# Altium project miaow-foc-board.prjpcb (part 2 of 2)

## Sheet emmc.schdoc: EMMC
size A4; Date: 10.25.2025; CheckedBy: BCY; DrawnBy: miaow; DocumentNumber: 4; Revision: v1.0.0; SheetNumber: 4; SheetTotal: 14; BoardType: MAIN_PCB; Desc: EMMC for mcu
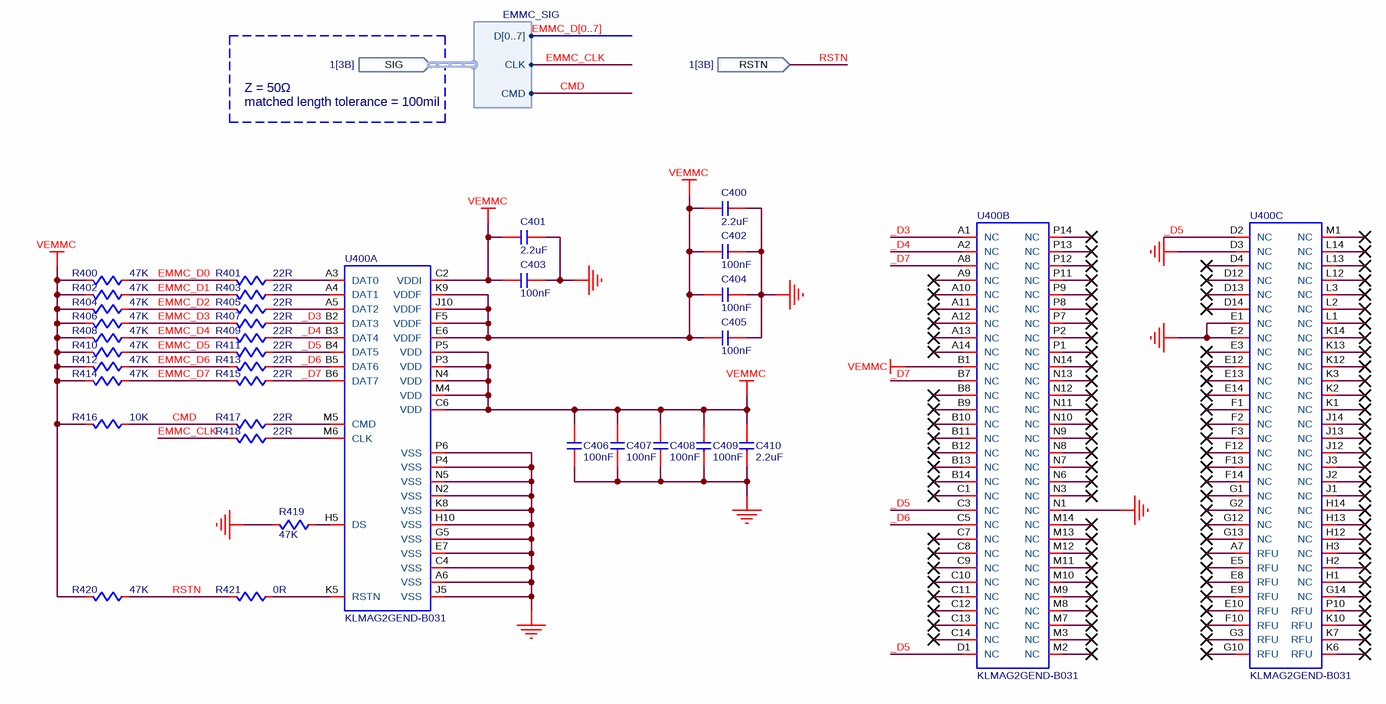
[diagram p8: emmc.schdoc]

### Parts
C400  value 2.2uF  [C0402]  (hidden comment: C-NOMO)
C401  value 2.2uF  [C0402]  (hidden comment: C-NOMO)
C402  value 100nF  [C0402]  (hidden comment: C-NOMO)
C403  value 100nF  [C0402]  (hidden comment: C-NOMO)
C404  value 100nF  [C0402]  (hidden comment: C-NOMO)
C405  value 100nF  [C0402]  (hidden comment: C-NOMO)
C406  value 100nF  [C0402]  (hidden comment: C-NOMO)
C407  value 100nF  [C0402]  (hidden comment: C-NOMO)
C408  value 100nF  [C0402]  (hidden comment: C-NOMO)
C409  value 100nF  [C0402]  (hidden comment: C-NOMO)
C410  value 2.2uF  [C0402]  (hidden comment: C-NOMO)
R400  value 47K  [R0402]  (hidden comment: R)
R401  value 22R  [R0402]  (hidden comment: R)
R402  value 47K  [R0402]  (hidden comment: R)
R403  value 22R  [R0402]  (hidden comment: R)
R404  value 47K  [R0402]  (hidden comment: R)
R405  value 22R  [R0402]  (hidden comment: R)
R406  value 47K  [R0402]  (hidden comment: R)
R407  value 22R  [R0402]  (hidden comment: R)
R408  value 47K  [R0402]  (hidden comment: R)
R409  value 22R  [R0402]  (hidden comment: R)
R410  value 47K  [R0402]  (hidden comment: R)
R411  value 22R  [R0402]  (hidden comment: R)
R412  value 47K  [R0402]  (hidden comment: R)
R413  value 22R  [R0402]  (hidden comment: R)
R414  value 47K  [R0402]  (hidden comment: R)
R415  value 22R  [R0402]  (hidden comment: R)
R416  value 10K  [R0402]  (hidden comment: R)
R417  value 22R  [R0402]  (hidden comment: R)
R418  value 22R  [R0402]  (hidden comment: R)
R419  value 47K  [R0402]  (hidden comment: R)
R420  value 47K  [R0402]  (hidden comment: R)
R421  value 0R  [R0402]  (hidden comment: R)
U400  KLMAG2GEND-B031  [KLMAG2GEND-B031]  (parts A,B,C of 3)

### Ports
RSTN (in, see 1[3B]), SIG (in, harness EMMC_SIG, see 1[3B])

### Harnesses
EMMC_SIG: D[0..7], CLK, CMD

### Nets
GND: C400.1 C401.1 C402.1 C403.1 C404.1 C405.1 C406.1 C407.1 C408.1 C409.1 C410.1 R419.1 U400.A6(VSS) U400.C4(VSS) U400.D3(NC) U400.E1(NC) U400.E2(NC) U400.E7(VSS) U400.G5(VSS) U400.H10(VSS) U400.J5(VSS) U400.K8(VSS) U400.N1(NC) U400.N2(VSS) U400.N5(VSS) U400.P4(VSS) U400.P6(VSS)  [project net GDRVA]
VEMMC: C400.2 C401.2 C402.2 C403.2 C404.2 C405.2 C406.2 C407.2 C408.2 C409.2 C410.2 R400.1 R402.1 R404.1 R406.1 R408.1 R410.1 R412.1 R414.1 R416.1 R420.1 U400.B1(NC) U400.C2(VDDI) U400.C6(VDD) U400.E6(VDDF) U400.F5(VDDF) U400.J10(VDDF) U400.K9(VDDF) U400.M4(VDD) U400.N4(VDD) U400.P3(VDD) U400.P5(VDD)  [project net +3V3]
_D3: R407.2 U400.A1(NC) U400.B2(DAT3)
_D4: R409.2 U400.A2(NC) U400.B3(DAT4)
_D5: R411.2 U400.B4(DAT5) U400.C3(NC) U400.D1(NC) U400.D2(NC)
_D6: R413.2 U400.B5(DAT6) U400.C5(NC)
_D7: R415.2 U400.A8(NC) U400.B6(DAT7) U400.B7(NC)
CMD: R416.2 R417.1 ; port SIG.CMD
EMMC_CLK: R418.1 ; port SIG.CLK
EMMC_D0: R400.2 R401.1
EMMC_D1: R402.2 R403.1
EMMC_D2: R404.2 R405.1
EMMC_D3: R406.2 R407.1
EMMC_D4: R408.2 R409.1
EMMC_D5: R410.2 R411.1
EMMC_D6: R412.2 R413.1
EMMC_D7: R414.2 R415.1
RSTN: R420.2 R421.1 ; port RSTN  [project net NRST]
NetR401_2: R401.2 U400.A3(DAT0)
NetR403_2: R403.2 U400.A4(DAT1)
NetR405_2: R405.2 U400.A5(DAT2)
NetR417_2: R417.2 U400.M5(CMD)
NetR418_2: R418.2 U400.M6(CLK)
NetR419_2: R419.2 U400.H5(DS)
NetR421_2: R421.2 U400.K5(RSTN)

Not connected (* = marked no-connect by the designer): U400 A7(RFU)* A9(NC)* A10(NC)* A11(NC)* A12(NC)* A13(NC)* A14(NC)* B8(NC)* B9(NC)* B10(NC)* B11(NC)* B12(NC)* B13(NC)* B14(NC)* C1(NC)* C7(NC)* C8(NC)* C9(NC)* C10(NC)* C11(NC)* C12(NC)* C13(NC)* C14(NC)* D4(NC)* D12(NC)* D13(NC)* D14(NC)* E3(NC)* E5(RFU)* E8(RFU)* E9(RFU)* E10(RFU)* E12(NC)* E13(NC)* E14(NC)* F1(NC)* F2(NC)* F3(NC)* F10(RFU)* F12(NC)* F13(NC)* F14(NC)* G1(NC)* G2(NC)* G3(RFU)* G10(RFU)* G12(NC)* G13(NC)* G14(NC)* H1(NC)* H2(NC)* H3(NC)* H12(NC)* H13(NC)* H14(NC)* J1(NC)* J2(NC)* J3(NC)* J12(NC)* J13(NC)* J14(NC)* K1(NC)* K2(NC)* K3(NC)* K6(RFU)* K7(RFU)* K10(RFU)* K12(NC)* K13(NC)* K14(NC)* L1(NC)* L2(NC)* L3(NC)* L12(NC)* L13(NC)* L14(NC)* M1(NC)* M2(NC)* M3(NC)* M7(NC)* M8(NC)* M9(NC)* M10(NC)* M11(NC)* M12(NC)* M13(NC)* M14(NC)* N3(NC)* N6(NC)* N7(NC)* N8(NC)* N9(NC)* N10(NC)* N11(NC)* N12(NC)* N13(NC)* N14(NC)* P1(NC)* P2(NC)* P7(NC)* P8(NC)* P9(NC)* P10(RFU)* P11(NC)* P12(NC)* P13(NC)* P14(NC)*

### Buses and harness runs
bus EMMC_D[0..7]

### Notes on the sheet
- Z = 50Ω
  matched length tolerance = 100mil
- DRAWN
- CHECKED
- DRAWNBY
- SHEETS
- SHEETS_NO

### Library data of the parts
C400-C410 = C-NOMO: voltage: 25V; precision: 5%
R400-R421 = R: precision: 1%
U400 = KLMAG2GEND-B031: EMMC; Supplier 1: Win Source; Supplier Part Number 1: 826874-KLMAG2GEND-B031

## Sheet flash.schdoc: FLASH
size A4; Date: 10.25.2025; CheckedBy: BCY; DrawnBy: miaow; DocumentNumber: 5; Revision: v1.0.0; SheetNumber: 5; SheetTotal: 14; BoardType: MAIN_PCB; Desc: NOR flash for mcu
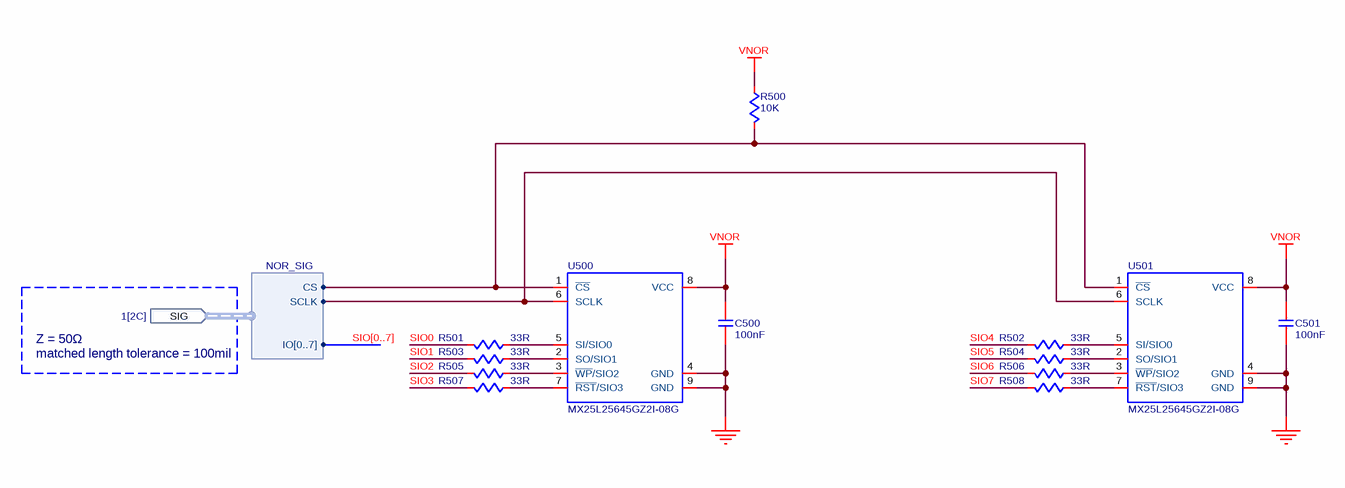
[diagram p9: flash.schdoc]

### Parts
C500  value 100nF  [C0402]  (hidden comment: C-NOMO)
C501  value 100nF  [C0402]  (hidden comment: C-NOMO)
R500  value 10K  [R0402]  (hidden comment: R)
R501  value 33R  [R0402]  (hidden comment: R)
R502  value 33R  [R0402]  (hidden comment: R)
R503  value 33R  [R0402]  (hidden comment: R)
R504  value 33R  [R0402]  (hidden comment: R)
R505  value 33R  [R0402]  (hidden comment: R)
R506  value 33R  [R0402]  (hidden comment: R)
R507  value 33R  [R0402]  (hidden comment: R)
R508  value 33R  [R0402]  (hidden comment: R)
U500  MX25L25645GZ2I-08G  [MX25L25645GZ2I-08G]
U501  MX25L25645GZ2I-08G  [MX25L25645GZ2I-08G]

### Ports
SIG (in, harness NOR_SIG, see 1[2C])

### Harnesses
NOR_SIG: CS, SCLK, IO[0..7]

### Nets
GND: C500.1 C501.1 U500.4(GND) U500.9(GND) U501.4(GND) U501.9(GND)  [project net GDRVA]
VNOR: C500.2 C501.2 R500.2 U500.8(VCC) U501.8(VCC)  [project net +3V3]
NOR_CS: R500.1 U500.1(~{CS}) U501.1(~{CS}) ; port SIG.CS
NOR_SCLK: U500.6(SCLK) U501.6(SCLK) ; port SIG.SCLK
SIO0: R501.1  [project net NOR_IO0]
SIO1: R503.1  [project net NOR_IO1]
SIO2: R505.1  [project net NOR_IO2]
SIO3: R507.1  [project net NOR_IO3]
SIO4: R502.1  [project net NOR_IO4]
SIO5: R504.1  [project net NOR_IO5]
SIO6: R506.1  [project net NOR_IO6]
SIO7: R508.1  [project net NOR_IO7]
NetR501_2: R501.2 U500.5(SI/SIO0)
NetR502_2: R502.2 U501.5(SI/SIO0)
NetR503_2: R503.2 U500.2(SO/SIO1)
NetR504_2: R504.2 U501.2(SO/SIO1)
NetR505_2: R505.2 U500.3(~{WP}/SIO2)
NetR506_2: R506.2 U501.3(~{WP}/SIO2)
NetR507_2: R507.2 U500.7(~{RST}/SIO3)
NetR508_2: R508.2 U501.7(~{RST}/SIO3)

### Buses and harness runs
bus SIO[0..7]

### Notes on the sheet
- Z = 50Ω
  matched length tolerance = 100mil
- DRAWN
- CHECKED
- DRAWNBY
- SHEETS
- SHEETS_NO

### Library data of the parts
C500 C501 = C-NOMO: voltage: 25V; precision: 5%
R500-R508 = R: precision: 1%
U500 U501 = MX25L25645GZ2I-08G: Supplier 1: LCSC; Supplier Part Number 1: C2802978

## Sheet debug.schdoc: DBG
size A4; Date: 10.25.2025; CheckedBy: BCY; DrawnBy: miaow; DocumentNumber: 7; Revision: v1.1.0; SheetNumber: 7; SheetTotal: 14; BoardType: MAIN_PCB; Desc: Debug board interface
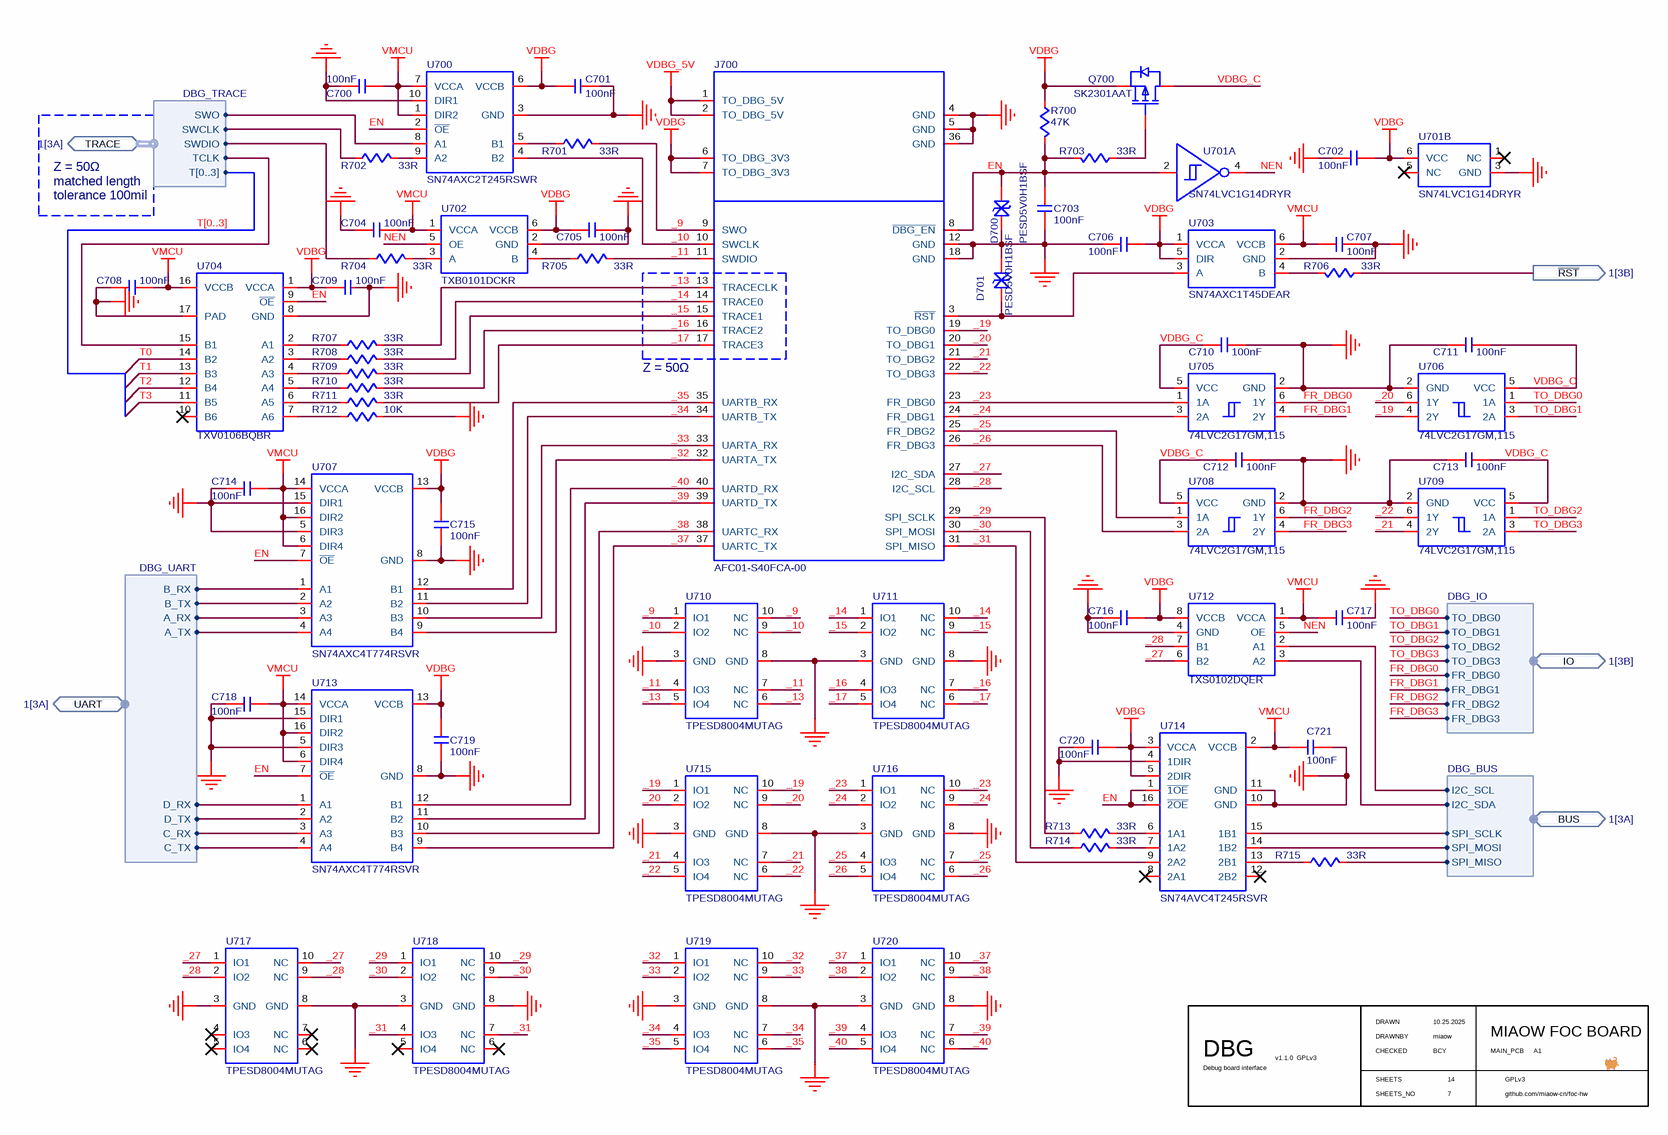
[diagram p10: debug.schdoc]

### Parts
C700  value 100nF  [C0402]  (hidden comment: C-NOMO)
C701  value 100nF  [C0402]  (hidden comment: C-NOMO)
C702  value 100nF  [C0402]  (hidden comment: C-NOMO)
C703  value 100nF  [C0402]  (hidden comment: C-NOMO)
C704  value 100nF  [C0402]  (hidden comment: C-NOMO)
C705  value 100nF  [C0402]  (hidden comment: C-NOMO)
C706  value 100nF  [C0402]  (hidden comment: C-NOMO)
C707  value 100nF  [C0402]  (hidden comment: C-NOMO)
C708  value 100nF  [C0402]  (hidden comment: C-NOMO)
C709  value 100nF  [C0402]  (hidden comment: C-NOMO)
C710  value 100nF  [C0402]  (hidden comment: C-NOMO)
C711  value 100nF  [C0402]  (hidden comment: C-NOMO)
C712  value 100nF  [C0402]  (hidden comment: C-NOMO)
C713  value 100nF  [C0402]  (hidden comment: C-NOMO)
C714  value 100nF  [C0402]  (hidden comment: C-NOMO)
C715  value 100nF  [C0402]  (hidden comment: C-NOMO)
C716  value 100nF  [C0402]  (hidden comment: C-NOMO)
C717  value 100nF  [C0402]  (hidden comment: C-NOMO)
C718  value 100nF  [C0402]  (hidden comment: C-NOMO)
C719  value 100nF  [C0402]  (hidden comment: C-NOMO)
C720  value 100nF  [C0402]  (hidden comment: C-NOMO)
C721  value 100nF  [C0402]  (hidden comment: C-NOMO)
D700  PESD5V0H1BSF  [PESD5V0H1BSF]
D701  PESD5V0H1BSF  [PESD5V0H1BSF]
J700  AFC01-S40FCA-00  [AFC01-S40FCA-00]
Q700  SK2301AAT  [SK2301AAT]
R700  value 47K  [R0402]  (hidden comment: R)
R701  value 33R  [R0402]  (hidden comment: R)
R702  value 33R  [R0402]  (hidden comment: R)
R703  value 33R  [R0402]  (hidden comment: R)
R704  value 33R  [R0402]  (hidden comment: R)
R705  value 33R  [R0402]  (hidden comment: R)
R706  value 33R  [R0402]  (hidden comment: R)
R707  value 33R  [R0402]  (hidden comment: R)
R708  value 33R  [R0402]  (hidden comment: R)
R709  value 33R  [R0402]  (hidden comment: R)
R710  value 33R  [R0402]  (hidden comment: R)
R711  value 33R  [R0402]  (hidden comment: R)
R712  value 10K  [R0402]  (hidden comment: R)
R713  value 33R  [R0402]  (hidden comment: R)
R714  value 33R  [R0402]  (hidden comment: R)
R715  value 33R  [R0402]  (hidden comment: R)
U700  SN74AXC2T245RSWR  [SN74AXC2T245RSWR]
U701  SN74LVC1G14DRYR  [SN74LVC1G14DRYR]  (parts A,B of 2)
U702  TXB0101DCKR  [TXB0101DCKR]
U703  SN74AXC1T45DEAR  [SN74AXC1T45DEAR]
U704  TXV0106BQBR  [TXV0106BQBR]
U705  74LVC2G17GM,115  [74LVC2G17GM,115]
U706  74LVC2G17GM,115  [74LVC2G17GM,115]
U707  SN74AXC4T774RSVR  [SN74AXC4T774RSVR]
U708  74LVC2G17GM,115  [74LVC2G17GM,115]
U709  74LVC2G17GM,115  [74LVC2G17GM,115]
U710  TPESD8004MUTAG  [TPESD8004MUTAG]
U711  TPESD8004MUTAG  [TPESD8004MUTAG]
U712  TXS0102DQER  [TXS0102DQER]
U713  SN74AXC4T774RSVR  [SN74AXC4T774RSVR]
U714  SN74AVC4T245RSVR  [SN74AVC4T245RSVR]
U715  TPESD8004MUTAG  [TPESD8004MUTAG]
U716  TPESD8004MUTAG  [TPESD8004MUTAG]
U717  TPESD8004MUTAG  [TPESD8004MUTAG]
U718  TPESD8004MUTAG  [TPESD8004MUTAG]
U719  TPESD8004MUTAG  [TPESD8004MUTAG]
U720  TPESD8004MUTAG  [TPESD8004MUTAG]

### Ports
BUS (bidir, harness DBG_BUS, see 1[3A]), IO (bidir, harness DBG_IO, see 1[3B]), TRACE (bidir, harness DBG_TRACE, see 1[3A]), UART (bidir, harness DBG_UART, see 1[3A]), ~{RST} (out, see 1[3B])

### Harnesses
DBG_UART: A_TX, A_RX, B_TX, B_RX, C_TX, C_RX, D_TX, D_RX
DBG_TRACE: SWO, SWCLK, SWDIO, TCLK, T[0..3]
DBG_BUS: I2C_SCL, I2C_SDA, SPI_MISO, SPI_MOSI, SPI_SCLK
DBG_IO: TO_DBG0, TO_DBG1, FR_DBG0, TO_DBG3, TO_DBG2, FR_DBG1, FR_DBG2, FR_DBG3

### Nets
GND: C700.2 C701.1 C702.1 C703.2 C704.1 C705.2 C706.1 C707.2 C708.2 C709.2 C710.1 C711.2 C712.1 C713.1 C714.2 C715.1 C716.1 C717.2 C718.2 C719.1 C720.1 C721.2 D700.1 D701.2 J700.4(GND) J700.5(GND) J700.12(GND) J700.18(GND) J700.36(GND) R712.2 U700.3(GND) U700.10(DIR1) U701.3(GND) U702.2(GND) U703.2(GND) U704.8(GND) U704.17(PAD) U705.2(GND) U706.2(GND) U707.5(DIR3) U707.8(GND) U707.15(DIR1) U708.2(GND) U709.2(GND) U710.3(GND) U710.8(GND) U711.3(GND) U711.8(GND) U712.4(GND) U713.5(DIR3) U713.8(GND) U713.15(DIR1) U714.4(1DIR) U714.10(GND) U714.11(GND) U715.3(GND) U715.8(GND) U716.3(GND) U716.8(GND) U717.3(GND) U717.8(GND) U718.3(GND) U718.8(GND) U719.3(GND) U719.8(GND) U720.3(GND) U720.8(GND)  [project net GDRVA]
VDBG: C700.1 C701.2 C702.2 C704.2 C705.1 C706.2 C707.1 C708.1 C709.1 C714.1 C715.2 C716.2 C717.1 C718.1 C719.2 C720.2 C721.1 J700.6(TO_DBG_3V3) J700.7(TO_DBG_3V3) Q700.S R700.1 U700.1(DIR2) U700.6(VCCB) U700.7(VCCA) U701.6(VCC) U702.1(VCCA) U702.6(VCCB) U703.1(VCCA) U703.5(DIR) U703.6(VCCB) U704.1(VCCA) U704.16(VCCB) U707.6(DIR4) U707.13(VCCB) U707.14(VCCA) U707.16(DIR2) U712.1(VCCA) U712.8(VCCB) U713.6(DIR4) U713.13(VCCB) U713.14(VCCA) U713.16(DIR2) U714.2(VCCB) U714.3(VCCA) U714.5(2DIR)  [also labelled VMCU]  [project net +3V3]
VDBG_5V: J700.1(TO_DBG_5V) J700.2(TO_DBG_5V)  [project net +5V]
_9: J700.9(SWO) R701.2 U710.1(IO1) U710.10(NC)
_10: J700.10(SWCLK) U700.4(B2) U710.2(IO2) U710.9(NC)
_11: J700.11(SWDIO) R705.2 U710.4(IO3) U710.7(NC)
_13: J700.13(TRACECLK) R707.2 U710.5(IO4) U710.6(NC)
_14: J700.14(TRACE0) R708.2 U711.1(IO1) U711.10(NC)
_15: J700.15(TRACE1) R709.2 U711.2(IO2) U711.9(NC)
_16: J700.16(TRACE2) R710.2 U711.4(IO3) U711.7(NC)
_17: J700.17(TRACE3) R711.2 U711.5(IO4) U711.6(NC)
_19: J700.19(TO_DBG0) U706.4(2Y) U715.1(IO1) U715.10(NC)
_20: J700.20(TO_DBG1) U706.6(1Y) U715.2(IO2) U715.9(NC)
_21: J700.21(TO_DBG2) U709.4(2Y) U715.4(IO3) U715.7(NC)
_22: J700.22(TO_DBG3) U709.6(1Y) U715.5(IO4) U715.6(NC)
_23: J700.23(FR_DBG0) U705.1(1A) U716.1(IO1) U716.10(NC)
_24: J700.24(FR_DBG1) U705.3(2A) U716.2(IO2) U716.9(NC)
_25: J700.25(FR_DBG2) U708.1(1A) U716.4(IO3) U716.7(NC)
_26: J700.26(FR_DBG3) U708.3(2A) U716.5(IO4) U716.6(NC)
_27: J700.27(I2C_SDA) U712.6(B2) U717.1(IO1) U717.10(NC)
_28: J700.28(I2C_SCL) U712.7(B1) U717.2(IO2) U717.9(NC)
_29: J700.29(SPI_SCLK) R713.1 U718.1(IO1) U718.10(NC)
_30: J700.30(SPI_MOSI) R714.1 U718.2(IO2) U718.9(NC)
_31: J700.31(SPI_MISO) U714.9(2A2) U718.4(IO3) U718.7(NC)
_32: J700.32(UARTA_TX) U707.9(B4) U719.1(IO1) U719.10(NC)
_33: J700.33(UARTA_RX) U707.10(B3) U719.2(IO2) U719.9(NC)
_34: J700.34(UARTB_TX) U707.11(B2) U719.4(IO3) U719.7(NC)
_35: J700.35(UARTB_RX) U707.12(B1) U719.5(IO4) U719.6(NC)
_37: J700.37(UARTC_TX) U713.9(B4) U720.1(IO1) U720.10(NC)
_38: J700.38(UARTC_RX) U713.10(B3) U720.2(IO2) U720.9(NC)
_39: J700.39(UARTD_TX) U713.11(B2) U720.4(IO3) U720.7(NC)
_40: J700.40(UARTD_RX) U713.12(B1) U720.5(IO4) U720.6(NC)
DBG_A_RX: U707.3(A3) ; port UART.A_RX
DBG_A_TX: U707.4(A4) ; port UART.A_TX
DBG_B_RX: U707.1(A1) ; port UART.B_RX
DBG_B_TX: U707.2(A2) ; port UART.B_TX
DBG_C_RX: U713.3(A3) ; port UART.C_RX
DBG_C_TX: U713.4(A4) ; port UART.C_TX
DBG_D_RX: U713.1(A1) ; port UART.D_RX
DBG_D_TX: U713.2(A2) ; port UART.D_TX
DBG_MISO: R715.2 ; port BUS.SPI_MISO
DBG_MOSI: U714.14(1B2) ; port BUS.SPI_MOSI
DBG_SCL: U712.2(A1) ; port BUS.I2C_SCL
DBG_SCLK: U714.15(1B1) ; port BUS.SPI_SCLK
DBG_SDA: U712.3(A2) ; port BUS.I2C_SDA
EN: C703.1 D700.2 J700.8(~{DBG_EN}) R700.2 R703.2 U700.2(~{OE}) U701.2(A) U704.9(~{OE}) U707.7(~{OE}) U713.7(~{OE}) U714.1(~{1OE}) U714.16(~{2OE})
FR_DBG0: U705.6(1Y) ; port IO.FR_DBG0  [project net BOOT0]
FR_DBG1: U705.4(2Y) ; port IO.FR_DBG1
FR_DBG2: U708.6(1Y) ; port IO.FR_DBG2
FR_DBG3: U708.4(2Y) ; port IO.FR_DBG3
NEN: U701.4(Y) U702.5(OE) U712.5(OE)
NRST: R706.1 ; port ~{RST}
SWCLK: R702.1 ; port TRACE.SWCLK
SWDIO: R704.1 ; port TRACE.SWDIO
SWO: U700.8(A1) ; port TRACE.SWO
T0: U704.14(B2)
T1: U704.13(B3)
T2: U704.12(B4)
T3: U704.11(B5)
TCLK: U704.15(B1) ; port TRACE.TCLK
TO_DBG0: U706.1(1A) ; port IO.TO_DBG0
TO_DBG1: U706.3(2A) ; port IO.TO_DBG1
TO_DBG2: U709.1(1A) ; port IO.TO_DBG2
TO_DBG3: U709.3(2A) ; port IO.TO_DBG3
VDBG_C: C710.2 C711.1 C712.2 C713.2 Q700.D U705.5(VCC) U706.5(VCC) U708.5(VCC) U709.5(VCC)
NetD701_1: D701.1 J700.3(~{RST}) U703.3(A)
NetQ700_G: Q700.G R703.1
NetR701_1: R701.1 U700.5(B1)
NetR702_2: R702.2 U700.9(A2)
NetR704_2: R704.2 U702.3(A)
NetR705_1: R705.1 U702.4(B)
NetR706_2: R706.2 U703.4(B)
NetR707_1: R707.1 U704.2(A1)
NetR708_1: R708.1 U704.3(A2)
NetR709_1: R709.1 U704.4(A3)
NetR710_1: R710.1 U704.5(A4)
NetR711_1: R711.1 U704.6(A5)
NetR712_1: R712.1 U704.7(A6)
NetR713_2: R713.2 U714.6(1A1)
NetR714_2: R714.2 U714.7(1A2)
NetR715_1: R715.1 U714.13(2B1)

Not connected (* = marked no-connect by the designer): U701 1(NC)* 5(NC)*; U704 10(B6)*; U714 8(2A1)* 12(2B2)*; U717 4(IO3)* 5(IO4)* 6(NC)* 7(NC)*; U718 5(IO4)* 6(NC)*

### Buses and harness runs
bus T[0..3]

### Notes on the sheet
- Z = 50Ω
  matched length tolerance 100mil
- (near J700) Z = 50Ω
- DRAWN
- CHECKED
- DRAWNBY
- SHEETS
- SHEETS_NO

### Library data of the parts
C700-C721 = C-NOMO: voltage: 25V; precision: 5%
D700 D701 = PESD5V0H1BSF: TVS/ESD; Supplier 1: LCSC; Supplier Part Number 1: C477989
J700 = FPC-DEBUG: FPC; Supplier 1: LCSC; Supplier Part Number 1: C262674
Q700 = SK2301AAT: PMOS; Supplier 1: LCSC; Supplier Part Number 1: C5334586
R700-R715 = R: precision: 1%
U700 = SN74AXC2T245RSWR: LEVEL SHIFT; Supplier 1: LCSC; Supplier Part Number 1: C1882550
U701 = SN74LVC1G14DRYR: INVERTER - 1bit schmitt; Supplier 1: LCSC; Supplier Part Number 1: C2878125
U702 = TXB0101DCKR: LEVEL SHIFT; Supplier 1: LCSC; Supplier Part Number 1: C324081
U703 = SN74AXC1T45DEAR: LEVEL SHIFT - 1bit, 0.65V - 3.6V, 500Mbps; Supplier 1: LCSC; Supplier Part Number 1: C2677436
U704 = TXV0106BQBR: LEVEL SHIFT; Supplier 1: LCSC; Supplier Part Number 1: C22414342
U705 U706 U708 U709 = 74LVC2G17GM,115: SCHMITT - 2bits; Supplier 1: LCSC; Supplier Part Number 1: C548609
U707 U713 = SN74AXC4T774RSVR: LEVEL SHIFT - 4bits, 0.65V - 3.6V, 310Mbps; Supplier 1: LCSC; Supplier Part Number 1: C779392
U710 U711 U715-U720 = TPESD8004MUTAG: TVS/ESD; Supplier 1: LCSC; Supplier Part Number 1: C2827679
U714 = SN74AVC4T245RSVR: LEVEL SHIFT - 4bits, 2grps, 1.2V - 3.6V, 380Mbps; Supplier 1: LCSC; Supplier Part Number 1: C133244
U712 = TXS0102DQER: Supplier Part Number 1: C2652935; Supplier 1: LCSC; ComponentLink1Description: Datasheet; ComponentLink1URL: ..\ds\txs0102dqer.pdf

## Sheet tempature.schdoc: TEMP
size A4; Date: 10.25.2025; CheckedBy: BCY; DrawnBy: miaow; DocumentNumber: 8; Revision: v1.0.0; SheetNumber: 8; SheetTotal: 14; BoardType: MAIN_PCB; Desc: NTC tempature sensor
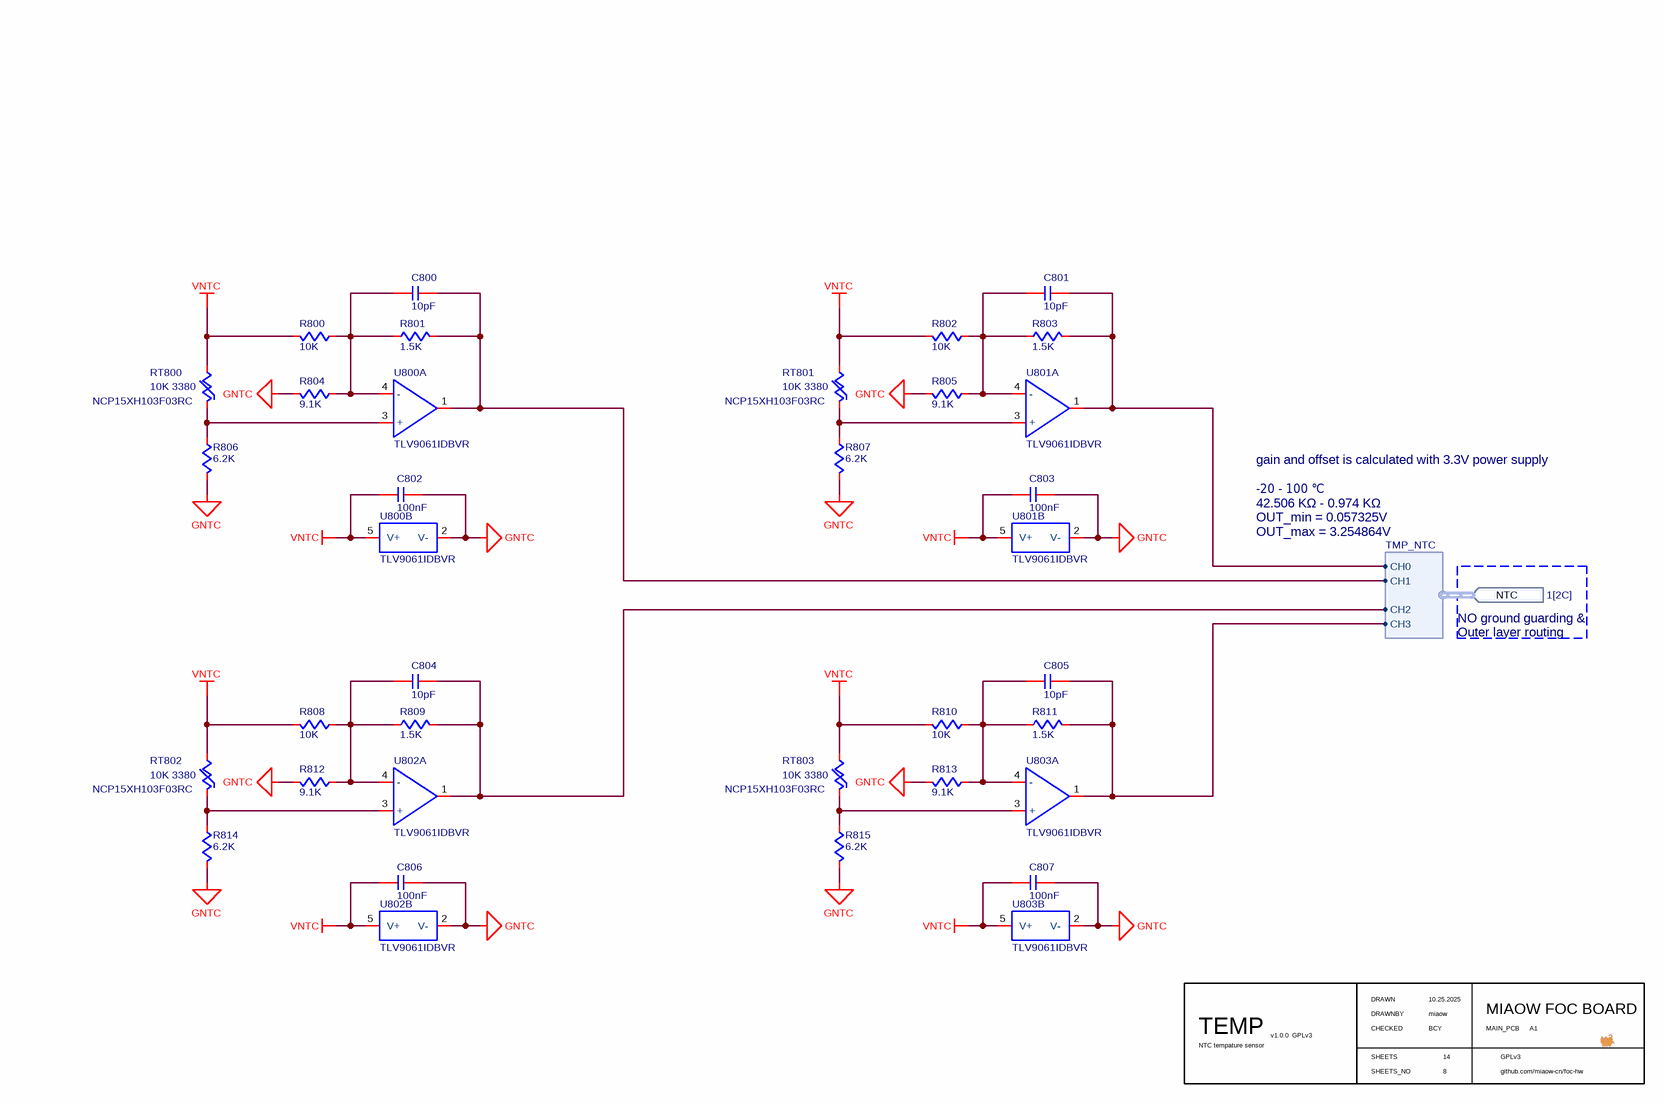
[diagram p11: tempature.schdoc]

### Parts
C800  value 10pF  [C0402]  (hidden comment: C-NOMO)
C801  value 10pF  [C0402]  (hidden comment: C-NOMO)
C802  value 100nF  [C0402]  (hidden comment: C-NOMO)
C803  value 100nF  [C0402]  (hidden comment: C-NOMO)
C804  value 10pF  [C0402]  (hidden comment: C-NOMO)
C805  value 10pF  [C0402]  (hidden comment: C-NOMO)
C806  value 100nF  [C0402]  (hidden comment: C-NOMO)
C807  value 100nF  [C0402]  (hidden comment: C-NOMO)
R800  value 10K  [R0402]  (hidden comment: R)
R801  value 1.5K  [R0402]  (hidden comment: R)
R802  value 10K  [R0402]  (hidden comment: R)
R803  value 1.5K  [R0402]  (hidden comment: R)
R804  value 9.1K  [R0402]  (hidden comment: R)
R805  value 9.1K  [R0402]  (hidden comment: R)
R806  value 6.2K  [R0402]  (hidden comment: R)
R807  value 6.2K  [R0402]  (hidden comment: R)
R808  value 10K  [R0402]  (hidden comment: R)
R809  value 1.5K  [R0402]  (hidden comment: R)
R810  value 10K  [R0402]  (hidden comment: R)
R811  value 1.5K  [R0402]  (hidden comment: R)
R812  value 9.1K  [R0402]  (hidden comment: R)
R813  value 9.1K  [R0402]  (hidden comment: R)
R814  value 6.2K  [R0402]  (hidden comment: R)
R815  value 6.2K  [R0402]  (hidden comment: R)
RT800  NCP15XH103F03RC  value 10K 3380  [NTC0402]
RT801  NCP15XH103F03RC  value 10K 3380  [NTC0402]
RT802  NCP15XH103F03RC  value 10K 3380  [NTC0402]
RT803  NCP15XH103F03RC  value 10K 3380  [NTC0402]
U800  TLV9061IDBVR  [TLV9061IDBVR]  (parts A,B of 2)
U801  TLV9061IDBVR  [TLV9061IDBVR]  (parts A,B of 2)
U802  TLV9061IDBVR  [TLV9061IDBVR]  (parts A,B of 2)
U803  TLV9061IDBVR  [TLV9061IDBVR]  (parts A,B of 2)

### Ports
NTC (in, harness TMP_NTC, see 1[2C])

### Harnesses
TMP_NTC: CH0, CH1, CH2, CH3

### Nets
GNTC: C802.1 C803.1 C806.1 C807.1 R804.1 R805.1 R806.1 R807.1 R812.1 R813.1 R814.1 R815.1 U800.2(V-) U801.2(V-) U802.2(V-) U803.2(V-)  [project net GDRVA]
VNTC: C802.2 C803.2 C806.2 C807.2 R800.1 R802.1 R808.1 R810.1 RT800.2 RT801.2 RT802.2 RT803.2 U800.5(V+) U801.5(V+) U802.5(V+) U803.5(V+)  [project net +3V3]
TMP_CH0: C801.1 R803.1 U801.1(OUT) ; port NTC.CH0
TMP_CH1: C800.1 R801.1 U800.1(OUT) ; port NTC.CH1
NetC800_2: C800.2 R800.2 R801.2 R804.2 U800.4(-)
NetC801_2: C801.2 R802.2 R803.2 R805.2 U801.4(-)
NetC804_1: C804.1 R809.1 U802.1(OUT) ; port NTC.CH2
NetC804_2: C804.2 R808.2 R809.2 R812.2 U802.4(-)
NetC805_1: C805.1 R811.1 U803.1(OUT) ; port NTC.CH3
NetC805_2: C805.2 R810.2 R811.2 R813.2 U803.4(-)
NetR806_2: R806.2 RT800.1 U800.3(+)
NetR807_2: R807.2 RT801.1 U801.3(+)
NetR814_2: R814.2 RT802.1 U802.3(+)
NetR815_2: R815.2 RT803.1 U803.3(+)

### Notes on the sheet
- gain and offset is calculated with 3.3V power supply
- -20 - 100 ℃
  42.506 KΩ - 0.974 KΩ
  OUT_min = 0.057325V
  OUT_max = 3.254864V
- NO ground guarding &
  Outer layer routing
- DRAWN
- CHECKED
- DRAWNBY
- SHEETS
- SHEETS_NO

### Library data of the parts
C800-C807 = C-NOMO: voltage: 25V; precision: 5%
R800-R815 = R: precision: 1%
RT800-RT803 = NCP15XH103F03RC: NTC - 10K, 3380, 1%; precision: 1%; Supplier Part Number 1: C13564; Supplier 1: LCSC
U800-U803 = TLV9061IDBVR: OPA - 1ch, 1.8V - 5.5V, r2r, 0.3mV, 10MHz, 10nVHz^0.5, 0.5pA; Supplier 1: LCSC; Supplier Part Number 1: C398358

## Sheet misc.schdoc: MISC
size A4; Date: 10.26.2025; CheckedBy: BCY; DrawnBy: miaow; DocumentNumber: 14; Revision: v1.0.0; SheetNumber: 14; SheetTotal: 14; BoardType: MAIN_PCB; Desc: Holes & marks
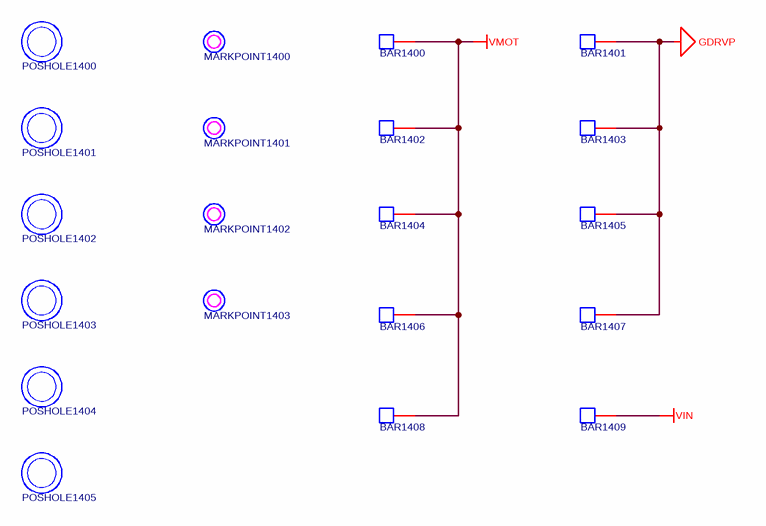
[diagram p12: misc.schdoc]

### Parts
BAR1400  BAR  [BAR3X20T1]  (value not drawn)
BAR1401  BAR  [BAR3X18T1]  (value not drawn)
BAR1402  BAR  [BAR3X8T1]  (value not drawn)
BAR1403  BAR  [BAR3X10T1]  (value not drawn)
BAR1404  BAR  [BAR3X8T1]  (value not drawn)
BAR1405  BAR  [BAR3X10T1]  (value not drawn)
BAR1406  BAR  [BAR3X6T1]  (value not drawn)
BAR1407  BAR  [BAR3X20T1]  (value not drawn)
BAR1408  BAR  [BAR3X18T1]  (value not drawn)
BAR1409  BAR  [BAR3X10T1]  (value not drawn)
MARKPOINT1400  MARKPOINT  [MARKPOINT-1.0]  (value not drawn)
MARKPOINT1401  MARKPOINT  [MARKPOINT-1.0]  (value not drawn)
MARKPOINT1402  MARKPOINT  [MARKPOINT-1.0]  (value not drawn)
MARKPOINT1403  MARKPOINT  [MARKPOINT-1.0]  (value not drawn)
POSHOLE1400  POSHOLE  [POSHOLE-3.2]  (value not drawn)
POSHOLE1401  POSHOLE  [POSHOLE-3.2]  (value not drawn)
POSHOLE1402  POSHOLE  [POSHOLE-3.2]  (value not drawn)
POSHOLE1403  POSHOLE  [POSHOLE-3.2]  (value not drawn)
POSHOLE1404  POSHOLE  [POSHOLE-3.2]  (value not drawn)
POSHOLE1405  POSHOLE  [POSHOLE-3.2]  (value not drawn)

### Nets
GDRVP: BAR1401.1 BAR1403.1 BAR1405.1 BAR1407.1
VIN: BAR1409.1
VMOT: BAR1400.1 BAR1402.1 BAR1404.1 BAR1406.1 BAR1408.1

### Notes on the sheet
- DRAWN
- CHECKED
- DRAWNBY
- SHEETS
- SHEETS_NO

### Library data of the parts
BAR1400-BAR1409 = BAR: SMD copper bar for current reinforcement

## Sheet encoder.schdoc: ENC
size A4; Date: 10.28.2025; CheckedBy: BCY; DrawnBy: miaow; DocumentNumber: 10; Revision: v1.0.0; SheetNumber: 10; SheetTotal: 14; BoardType: MAIN_PCB; Desc: Encoder interface
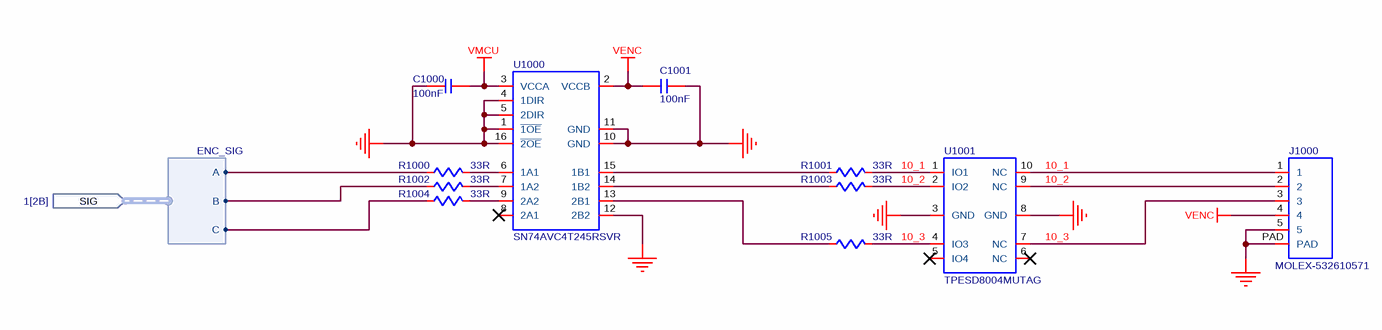
[diagram p13: encoder.schdoc]

### Parts
C1000  value 100nF  [C0402]  (hidden comment: C-NOMO)
C1001  value 100nF  [C0402]  (hidden comment: C-NOMO)
J1000  MOLEX-532610571  [MOLEX-532610571]
R1000  value 33R  [R0402]  (hidden comment: R)
R1001  value 33R  [R0402]  (hidden comment: R)
R1002  value 33R  [R0402]  (hidden comment: R)
R1003  value 33R  [R0402]  (hidden comment: R)
R1004  value 33R  [R0402]  (hidden comment: R)
R1005  value 33R  [R0402]  (hidden comment: R)
U1000  SN74AVC4T245RSVR  [SN74AVC4T245RSVR]
U1001  TPESD8004MUTAG  [TPESD8004MUTAG]

### Ports
SIG (in, harness ENC_SIG, see 1[2B])

### Harnesses
ENC_SIG: A, B, C

### Nets
GND: C1000.1 C1001.2 J1000.5 J1000.PAD U1000.1(~{1OE}) U1000.4(1DIR) U1000.5(2DIR) U1000.10(GND) U1000.11(GND) U1000.12(2B2) U1000.16(~{2OE}) U1001.3(GND) U1001.8(GND)  [project net GDRVA]
VENC: C1000.2 C1001.1 J1000.4 U1000.2(VCCB) U1000.3(VCCA)  [also labelled VMCU]  [project net +3V3]
10_1: J1000.1 R1001.2 U1001.1(IO1) U1001.10(NC)
10_2: J1000.2 R1003.2 U1001.2(IO2) U1001.9(NC)
10_3: J1000.3 R1005.2 U1001.4(IO3) U1001.7(NC)
ENC_A: R1000.1 ; port SIG.A
ENC_B: R1002.1 ; port SIG.B
NetR1000_2: R1000.2 U1000.6(1A1)
NetR1001_1: R1001.1 U1000.15(1B1)
NetR1002_2: R1002.2 U1000.7(1A2)
NetR1003_1: R1003.1 U1000.14(1B2)
NetR1004_1: R1004.1 ; port SIG.C
NetR1004_2: R1004.2 U1000.9(2A2)
NetR1005_1: R1005.1 U1000.13(2B1)

Not connected (* = marked no-connect by the designer): U1000 8(2A1)*; U1001 5(IO4)* 6(NC)*

### Notes on the sheet
- DRAWN
- CHECKED
- DRAWNBY
- SHEETS
- SHEETS_NO

### Library data of the parts
C1000 C1001 = C-NOMO: voltage: 25V; precision: 5%
J1000 = MOLEX-532610571: HEADER - 1.25 - 5p; Supplier 1: LCSC; Supplier Part Number 1: C668616; Supplier 2: LCSC; Supplier Part Number 2: C17256390
R1000-R1005 = R: precision: 1%
U1000 = SN74AVC4T245RSVR: as U714 on sheet debug; Supplier 1: LCSC; Supplier Part Number 1: C133244
U1001 = TPESD8004MUTAG: TVS/ESD; Supplier 1: LCSC; Supplier Part Number 1: C2827679

## Nets that join several sheets
+3V3: motor-driver (7 pins), ram (28 pins), power (7 pins), mcu-power (54 pins), mcu-io (11 pins), lcd (J600.6 J600.7), emmc (32 pins), flash (5 pins), debug (45 pins), tempature (16 pins), encoder (5 pins)
+5V: power (6 pins), lcd (J600.1 J600.2), debug (J700.1 J700.2)
GDRVA: motor-driver (21 pins), ram (28 pins), power (29 pins), mcu-power (84 pins), mcu-io (9 pins), lcd (20 pins), emmc (27 pins), flash (6 pins), debug (67 pins), tempature (16 pins), encoder (13 pins)
GDRVP: motor-driver (16 pins), power (10 pins), misc (BAR1401.1 BAR1403.1 BAR1405.1 BAR1407.1)
VIN: power (17 pins), misc (BAR1409.1)
VMCUA: power (L202.2), mcu-power (C1230.2 C1231.2 R1200.1 U1200.L1)
VMOT: motor-driver (20 pins), power (10 pins), misc (5 pins)
9_30: motor-driver (U900.30 U903.2 U903.9), mcu-io (R1315.2)
9_33: motor-driver (R905.2 U900.33 U904.1 U904.10), mcu-io (U1301.4)
9_34: motor-driver (U900.34 U904.2 U904.9), mcu-io (U1200.H17)
9_37: motor-driver (U900.37 U904.4 U904.7), mcu-io (R1319.2)
9_39: motor-driver (U900.39 U905.1 U905.10), mcu-io (R1323.2)
9_41: motor-driver (U900.41 U905.4 U905.7), mcu-io (R1326.2)
9_VBUS: motor-driver (10 pins), mcu-io (U1200.U4)
A0: ram (U300.G8), mcu-io (R1363.2)
A1: ram (U300.G9), mcu-io (R1365.2)
A2: ram (U300.F7), mcu-io (R1366.2)
A3: ram (U300.F3), mcu-io (R1367.2)
A4: ram (U300.G1), mcu-io (R1368.2)
A5: ram (U300.G2), mcu-io (R1369.2)
A6: ram (U300.G3), mcu-io (R1379.2)
A7: ram (U300.H1), mcu-io (R1380.2)
A8: ram (U300.H2), mcu-io (R1382.2)
A9: ram (U300.J3), mcu-io (R1384.2)
A10: ram (U300.G7), mcu-io (R1301.2)
A11: ram (U300.H9), mcu-io (R1304.2)
B0: mcu-io (U1200.D11), lcd (J600.12 U601.1 U601.10)
B1: mcu-io (U1200.C9), lcd (J600.16 U602.1 U602.10)
B2: mcu-io (U1200.E14), lcd (J600.19 U602.5 U602.6)
B3: mcu-io (U1200.B10), lcd (J600.18 U602.4 U602.7)
B4: mcu-io (U1200.C8), lcd (J600.17 U602.2 U602.9)
B5: mcu-io (U1200.B8), lcd (J600.15 U601.5 U601.6)
B6: mcu-io (U1200.A8), lcd (J600.14 U601.4 U601.7)
B7: mcu-io (U1200.C7), lcd (J600.13 U601.2 U601.9)
BA0: ram (U300.J7), mcu-io (R1309.2)
BA1: ram (U300.H8), mcu-io (R1312.2)
BL: mcu-io (U1200.A14), lcd (D600.1 J600.3)
BOOT0: mcu-io (C1302.1 R1385.2 U1200.E8), debug (U705.6)
CLK: mcu-io (U1200.H3), lcd (J600.37 U607.1 U607.10)
CMD: mcu-io (U1200.C11), emmc (R416.2 R417.1)
D0: ram (U300.R8), mcu-io (R1329.2)
D1: ram (U300.N7), mcu-io (R1331.2)
D2: ram (U300.R9), mcu-io (R1300.2)
D3: ram (U300.N8), mcu-io (R1303.2)
D4: ram (U300.M8), mcu-io (R1346.2)
D5: ram (U300.P9), mcu-io (R1348.2)
D6: ram (U300.M7), mcu-io (R1350.2)
D7: ram (U300.L8), mcu-io (R1352.2)
D8: ram (U300.N2), mcu-io (R1354.2)
D9: ram (U300.N3), mcu-io (R1356.2)
D10: ram (U300.P1), mcu-io (R1358.2)
D11: ram (U300.R2), mcu-io (R1360.2)
D12: ram (U300.R1), mcu-io (R1361.2)
D13: ram (U300.M3), mcu-io (R1317.2)
D14: ram (U300.L2), mcu-io (R1320.2)
D15: ram (U300.M2), mcu-io (R1324.2)
D16: ram (U300.D7), mcu-io (R1345.2)
D17: ram (U300.C7), mcu-io (R1347.2)
D18: ram (U300.C8), mcu-io (R1349.2)
D19: ram (U300.D8), mcu-io (R1351.2)
D20: ram (U300.E8), mcu-io (R1353.2)
D21: ram (U300.A8), mcu-io (R1355.2)
D22: ram (U300.B9), mcu-io (R1357.2)
D23: ram (U300.A9), mcu-io (R1359.2)
D24: ram (U300.C2), mcu-io (R1302.2)
D25: ram (U300.A1), mcu-io (R1305.2)
D26: ram (U300.B1), mcu-io (R1306.2)
D27: ram (U300.A2), mcu-io (R1307.2)
D28: ram (U300.D2), mcu-io (R1314.2)
D29: ram (U300.C3), mcu-io (R1316.2)
D30: ram (U300.E2), mcu-io (R1322.2)
D31: ram (U300.D3), mcu-io (R1325.2)
DBG_A_RX: mcu-io (U1200.U2), debug (U707.3)
DBG_A_TX: mcu-io (U1200.A11), debug (U707.4)
DBG_B_RX: mcu-io (U1200.P12), debug (U707.1)
DBG_B_TX: mcu-io (U1200.P11), debug (U707.2)
DBG_C_RX: mcu-io (U1200.N4), debug (U713.3)
DBG_C_TX: mcu-io (U1200.N5), debug (U713.4)
DBG_D_RX: mcu-io (U1200.D12), debug (U713.1)
DBG_D_TX: mcu-io (U1200.C12), debug (U713.2)
DBG_MISO: mcu-io (U1200.M3), debug (R715.2)
DBG_MOSI: mcu-io (R1364.2), debug (U714.14)
DBG_SCL: mcu-io (U1200.R16), debug (U712.2)
DBG_SCLK: mcu-io (R1327.2), debug (U714.15)
DBG_SDA: mcu-io (U1200.R17), debug (U712.3)
DE: mcu-io (U1200.D7), lcd (J600.9 U600.2 U600.9)
DM0: ram (U300.K9), mcu-io (R1333.2)
DM1: ram (U300.K1), mcu-io (R1335.2)
DM2: ram (U300.F8), mcu-io (R1310.2)
DM3: ram (U300.F2), mcu-io (R1313.2)
DRV_CS: motor-driver (R911.1), mcu-io (R1308.2)
DRV_FLT: motor-driver (R908.1), mcu-io (U1200.H16)
DRV_SCLK: motor-driver (R912.1), mcu-io (R1311.2)
DRV_SDO: motor-driver (R913.1), mcu-io (U1200.R3)
DRV_SNS_A: motor-driver (R916.1), mcu-io (U1200.T1)
DRV_SNS_B: motor-driver (R917.1), mcu-io (U1200.T2)
DRV_SNS_C: motor-driver (R919.1), mcu-io (U1200.T4)
EMMC_CLK: mcu-io (U1200.B11), emmc (R418.1)
EMMC_D0: mcu-io (U1200.U15), emmc (R400.2 R401.1)
EMMC_D1: mcu-io (U1200.T15), emmc (R402.2 R403.1)
EMMC_D2: mcu-io (U1200.B9), emmc (R404.2 R405.1)
EMMC_D3: mcu-io (U1200.B7), emmc (R406.2 R407.1)
EMMC_D4: mcu-io (U1200.D5), emmc (R408.2 R409.1)
EMMC_D5: mcu-io (U1200.D4), emmc (R410.2 R411.1)
EMMC_D6: mcu-io (U1200.F14), emmc (R412.2 R413.1)
EMMC_D7: mcu-io (U1200.F13), emmc (R414.2 R415.1)
ENC_A: mcu-io (U1200.B5), encoder (R1000.1)
ENC_B: mcu-io (U1200.C5), encoder (R1002.1)
FR_DBG1: mcu-io (C1301.1 R1383.1 U1200.E7), debug (U705.4)
FR_DBG2: mcu-io (U1200.E4), debug (U708.6)
FR_DBG3: mcu-io (U1200.F4), debug (U708.4)
G0: mcu-io (U1200.T5), lcd (J600.24 U604.1 U604.10)
G1: mcu-io (U1200.U5), lcd (J600.20 U603.1 U603.10)
G2: mcu-io (U1200.P5), lcd (J600.27 U604.5 U604.6)
G3: mcu-io (U1200.A9), lcd (J600.26 U604.4 U604.7)
G4: mcu-io (U1200.K14), lcd (J600.25 U604.2 U604.9)
G5: mcu-io (U1200.J14), lcd (J600.23 U603.5 U603.6)
G6: mcu-io (U1200.J15), lcd (J600.22 U603.4 U603.7)
G7: mcu-io (U1200.B12), lcd (J600.21 U603.2 U603.9)
HSYNC: mcu-io (U1200.H1), lcd (J600.11 U600.5 U600.6)
LCD_INT: mcu-io (U1200.D10), lcd (R600.2)
LCD_R0: mcu-io (U1200.D9), lcd (J600.28 U605.1 U605.10)
LCD_R1: mcu-io (U1200.N6), lcd (J600.32 U606.1 U606.10)
LCD_R2: mcu-io (U1200.P6), lcd (J600.35 U606.5 U606.6)
LCD_R3: mcu-io (U1200.T6), lcd (J600.34 U606.4 U606.7)
LCD_R4: mcu-io (U1200.U6), lcd (J600.33 U606.2 U606.9)
LCD_R5: mcu-io (U1200.U7), lcd (J600.31 U605.5 U605.6)
LCD_R6: mcu-io (U1200.E15), lcd (J600.30 U605.4 U605.7)
LCD_R7: mcu-io (U1200.G15), lcd (J600.29 U605.2 U605.9)
LCD_RST: mcu-io (U1200.E10), lcd (J600.8 U600.1 U600.10)
LCD_SCL: mcu-io (U1200.P3), lcd (R601.2)
LCD_SDA: mcu-io (U1200.P4), lcd (R602.2)
LCD_VSYNC: mcu-io (U1200.H2), lcd (J600.10 U600.4 U600.7)
NetC804_1: mcu-io (TP1301.0), tempature (C804.1 R809.1 U802.1)
NetC805_1: mcu-io (TP1302.0), tempature (C805.1 R811.1 U803.1)
NetR1004_1: mcu-io (TP1300.0), encoder (R1004.1)
NOR_CS: mcu-io (R1377.2), flash (R500.1 U500.1 U501.1)
NOR_IO0: mcu-io (R1373.2), flash (R501.1)
NOR_IO1: mcu-io (R1374.2), flash (R503.1)
NOR_IO2: mcu-io (R1371.2), flash (R505.1)
NOR_IO3: mcu-io (R1370.2), flash (R507.1)
NOR_IO4: mcu-io (R1334.2), flash (R502.1)
NOR_IO5: mcu-io (R1336.2), flash (R504.1)
NOR_IO6: mcu-io (R1321.2), flash (R506.1)
NOR_IO7: mcu-io (R1330.2), flash (R508.1)
NOR_SCLK: mcu-io (R1375.2), flash (U500.6 U501.6)
NRST: mcu-io (C1300.1 R1372.2 U1200.K1 U1301.1), emmc (R420.2 R421.1), debug (R706.1)
SDRAM_CAS: ram (U300.K7), mcu-io (R1332.2)
SDRAM_CKE: ram (U300.J2), mcu-io (R1343.2)
SDRAM_CLK: ram (U300.J1), mcu-io (R1318.2)
SDRAM_CS: ram (U300.J8), mcu-io (R1341.2)
SDRAM_RAS: ram (U300.J9), mcu-io (R1378.2)
SDRAM_WE: ram (U300.K8), mcu-io (R1362.2)
SWCLK: mcu-io (U1200.B14), debug (R702.1)
SWDIO: mcu-io (R1328.2), debug (R704.1)
SWO: mcu-io (R1338.2), debug (U700.8)
T0: mcu-io (R1339.2), debug (U704.14)
T1: mcu-io (R1340.2), debug (U704.13)
T2: mcu-io (R1342.2), debug (U704.12)
T3: mcu-io (R1344.2), debug (U704.11)
TCLK: mcu-io (R1337.2), debug (U704.15)
TMP_CH0: mcu-io (U1200.N3), tempature (C801.1 R803.1 U801.1)
TMP_CH1: mcu-io (U1200.M4), tempature (C800.1 R801.1 U800.1)
TO_DBG0: mcu-io (U1200.R15), debug (U706.1)
TO_DBG1: mcu-io (U1200.N14), debug (U706.3)
TO_DBG2: mcu-io (U1200.M14), debug (U709.1)
TO_DBG3: mcu-io (U1200.L14), debug (U709.3)

## Assembly variants
Variant of miaow-foc-board: not fitted R202